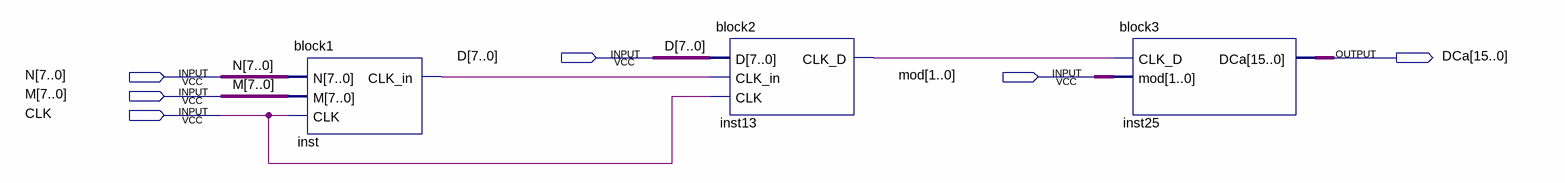
[diagram p0: schematic sheet]
// Quartus schematic Lab2.bdf as structural Verilog: 3 symbols, 6 pins
module Lab2 (
  input  [7:0] D,
  input  [7:0] N,
  input  [1:0] mod,
  input  [7:0] M,
  input  CLK,
  output [15:0] DCa
);

  wire inst13_clk_d, inst_clk_in;

  block1 inst (.N(N), .M(M), .CLK(CLK), .CLK_in(inst_clk_in));
  block2 inst13 (.D(D), .CLK_in(inst_clk_in), .CLK(CLK), .CLK_D(inst13_clk_d));
  block3 inst25 (.CLK_D(inst13_clk_d), .mod(mod), .DCa(DCa));
endmodule
